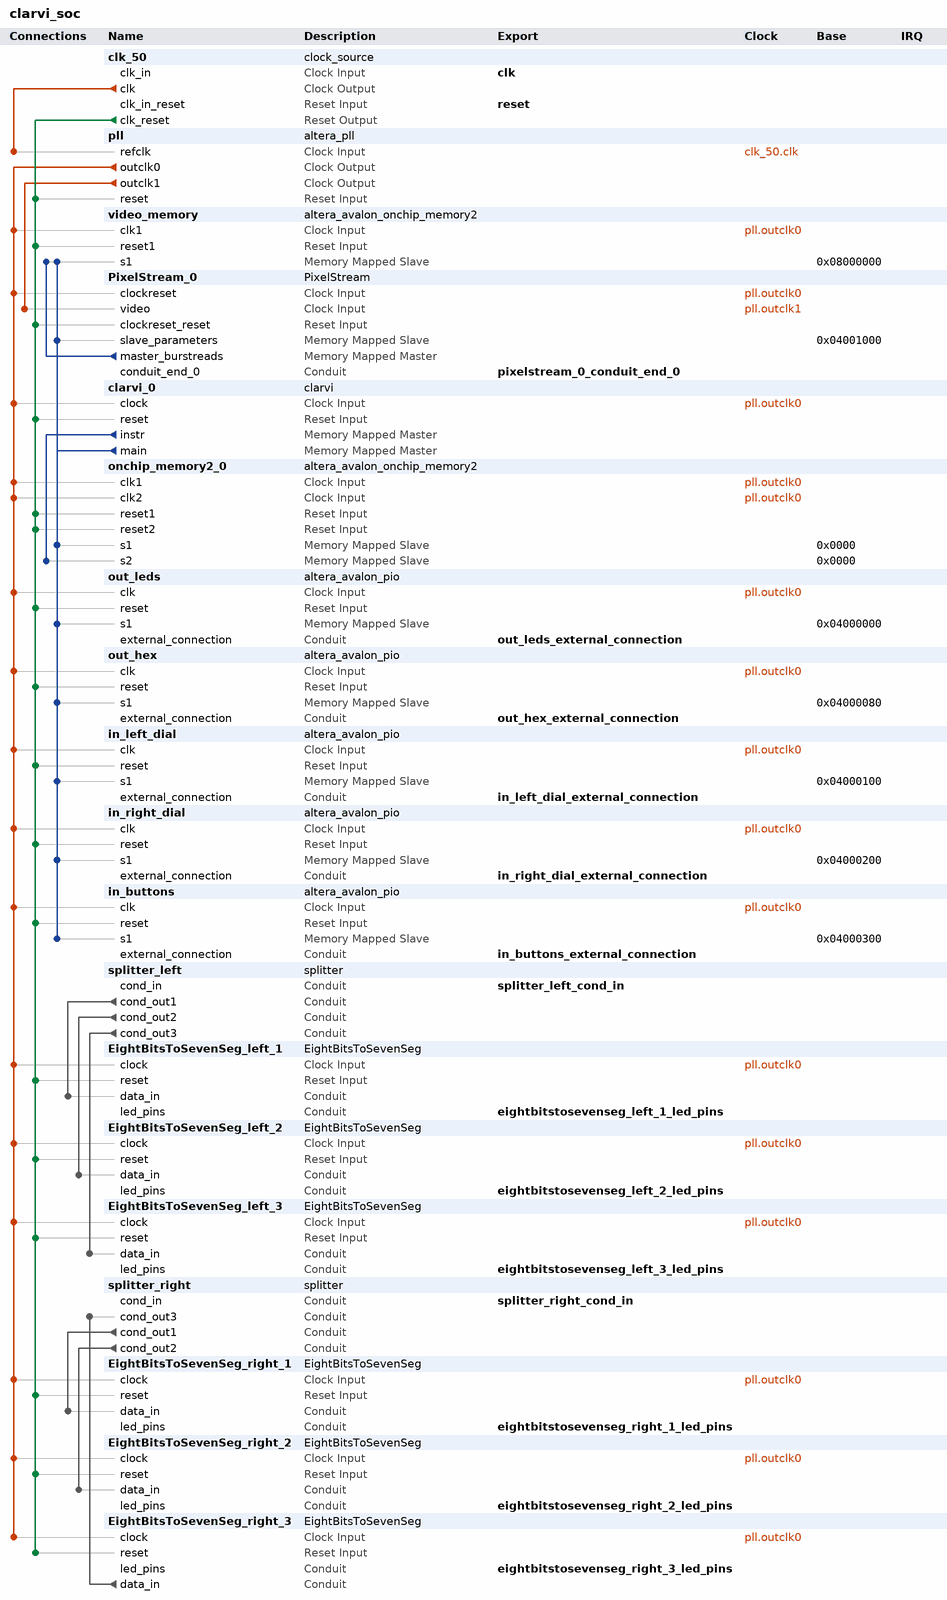
[diagram p0: system contents]
# Platform Designer (Qsys) system clarvi_soc, Cyclone V 5CSEMA5F31C6
# Parameters at their usual value, and those the tool derives, are not listed.
package require -exact qsys 16.1
create_system clarvi_soc
set_project_property DEVICE_FAMILY {Cyclone V}
set_project_property DEVICE 5CSEMA5F31C6

add_instance clk_50 clock_source 16.1
set_instance_parameter_value clk_50 clockFrequency 50000000

add_instance pll altera_pll 16.1
set_instance_parameter_value pll gui_device_speed_grade 2
set_instance_parameter_value pll gui_number_of_clocks 2
set_instance_parameter_value pll gui_operation_mode direct
set_instance_parameter_value pll gui_output_clock_frequency0 50.0
set_instance_parameter_value pll gui_output_clock_frequency1 9.0
set_instance_parameter_value pll gui_pll_mode {Integer-N PLL}
set_instance_parameter_value pll gui_reference_clock_frequency 50.0
set_instance_parameter_value pll gui_use_locked false

add_instance video_memory altera_avalon_onchip_memory2 16.1
set_instance_parameter_value video_memory dataWidth 32
set_instance_parameter_value video_memory dualPort false
set_instance_parameter_value video_memory initMemContent false
set_instance_parameter_value video_memory initializationFileName onchip_mem.hex
set_instance_parameter_value video_memory memorySize 261120

add_instance PixelStream_0 PixelStream 1.0

add_instance clarvi_0 clarvi 1.0
set_instance_parameter_value clarvi_0 DATA_ADDR_WIDTH 29
set_instance_parameter_value clarvi_0 DEFAULT_TRAP_VECTOR 0
set_instance_parameter_value clarvi_0 INITIAL_PC 0
set_instance_parameter_value clarvi_0 INSTR_ADDR_WIDTH 14

add_instance onchip_memory2_0 altera_avalon_onchip_memory2 16.1
set_instance_parameter_value onchip_memory2_0 dataWidth 32
set_instance_parameter_value onchip_memory2_0 dualPort true
set_instance_parameter_value onchip_memory2_0 initMemContent true
set_instance_parameter_value onchip_memory2_0 initializationFileName mem.hex
set_instance_parameter_value onchip_memory2_0 memorySize 65536
set_instance_parameter_value onchip_memory2_0 useNonDefaultInitFile true

add_instance out_leds altera_avalon_pio 16.1
set_instance_parameter_value out_leds direction Output
set_instance_parameter_value out_leds width 10

add_instance out_hex altera_avalon_pio 16.1
set_instance_parameter_value out_hex direction Output
set_instance_parameter_value out_hex width 24

add_instance in_left_dial altera_avalon_pio 16.1
set_instance_parameter_value in_left_dial direction Input
set_instance_parameter_value in_left_dial width 8

add_instance in_right_dial altera_avalon_pio 16.1
set_instance_parameter_value in_right_dial direction Input
set_instance_parameter_value in_right_dial width 8

add_instance in_buttons altera_avalon_pio 16.1
set_instance_parameter_value in_buttons direction Input
set_instance_parameter_value in_buttons width 16

add_instance splitter_left splitter 1.0

add_instance EightBitsToSevenSeg_left_1 EightBitsToSevenSeg 1.0

add_instance EightBitsToSevenSeg_left_2 EightBitsToSevenSeg 1.0

add_instance EightBitsToSevenSeg_left_3 EightBitsToSevenSeg 1.0

add_instance splitter_right splitter 1.0

add_instance EightBitsToSevenSeg_right_1 EightBitsToSevenSeg 1.0

add_instance EightBitsToSevenSeg_right_2 EightBitsToSevenSeg 1.0

add_instance EightBitsToSevenSeg_right_3 EightBitsToSevenSeg 1.0

# connections
add_connection clk_50.clk pll.refclk clock
add_connection pll.outclk0 clarvi_0.clock clock
add_connection pll.outclk0 EightBitsToSevenSeg_left_1.clock clock
add_connection pll.outclk0 EightBitsToSevenSeg_left_2.clock clock
add_connection pll.outclk0 EightBitsToSevenSeg_left_3.clock clock
add_connection pll.outclk0 EightBitsToSevenSeg_right_1.clock clock
add_connection pll.outclk0 EightBitsToSevenSeg_right_2.clock clock
add_connection pll.outclk0 EightBitsToSevenSeg_right_3.clock clock
add_connection pll.outclk0 in_buttons.clk clock
add_connection pll.outclk0 in_left_dial.clk clock
add_connection pll.outclk0 in_right_dial.clk clock
add_connection pll.outclk0 onchip_memory2_0.clk1 clock
add_connection pll.outclk0 onchip_memory2_0.clk2 clock
add_connection pll.outclk0 out_hex.clk clock
add_connection pll.outclk0 out_leds.clk clock
add_connection pll.outclk0 PixelStream_0.clockreset clock
add_connection pll.outclk0 video_memory.clk1 clock
add_connection pll.outclk1 PixelStream_0.video clock
add_connection clk_50.clk_reset clarvi_0.reset reset
add_connection clk_50.clk_reset EightBitsToSevenSeg_left_1.reset reset
add_connection clk_50.clk_reset EightBitsToSevenSeg_left_2.reset reset
add_connection clk_50.clk_reset EightBitsToSevenSeg_left_3.reset reset
add_connection clk_50.clk_reset EightBitsToSevenSeg_right_1.reset reset
add_connection clk_50.clk_reset EightBitsToSevenSeg_right_2.reset reset
add_connection clk_50.clk_reset EightBitsToSevenSeg_right_3.reset reset
add_connection clk_50.clk_reset in_buttons.reset reset
add_connection clk_50.clk_reset in_left_dial.reset reset
add_connection clk_50.clk_reset in_right_dial.reset reset
add_connection clk_50.clk_reset onchip_memory2_0.reset1 reset
add_connection clk_50.clk_reset onchip_memory2_0.reset2 reset
add_connection clk_50.clk_reset out_hex.reset reset
add_connection clk_50.clk_reset out_leds.reset reset
add_connection clk_50.clk_reset PixelStream_0.clockreset_reset reset
add_connection clk_50.clk_reset pll.reset reset
add_connection clk_50.clk_reset video_memory.reset1 reset
add_connection clarvi_0.instr onchip_memory2_0.s2 avalon
set_connection_parameter_value clarvi_0.instr/onchip_memory2_0.s2 baseAddress 0x0000
add_connection clarvi_0.main in_buttons.s1 avalon
set_connection_parameter_value clarvi_0.main/in_buttons.s1 baseAddress 0x04000300
add_connection clarvi_0.main in_left_dial.s1 avalon
set_connection_parameter_value clarvi_0.main/in_left_dial.s1 baseAddress 0x04000100
add_connection clarvi_0.main in_right_dial.s1 avalon
set_connection_parameter_value clarvi_0.main/in_right_dial.s1 baseAddress 0x04000200
add_connection clarvi_0.main onchip_memory2_0.s1 avalon
set_connection_parameter_value clarvi_0.main/onchip_memory2_0.s1 baseAddress 0x0000
add_connection clarvi_0.main out_hex.s1 avalon
set_connection_parameter_value clarvi_0.main/out_hex.s1 baseAddress 0x04000080
add_connection clarvi_0.main out_leds.s1 avalon
set_connection_parameter_value clarvi_0.main/out_leds.s1 baseAddress 0x04000000
add_connection clarvi_0.main PixelStream_0.slave_parameters avalon
set_connection_parameter_value clarvi_0.main/PixelStream_0.slave_parameters baseAddress 0x04001000
add_connection clarvi_0.main video_memory.s1 avalon
set_connection_parameter_value clarvi_0.main/video_memory.s1 baseAddress 0x08000000
add_connection PixelStream_0.master_burstreads video_memory.s1 avalon
set_connection_parameter_value PixelStream_0.master_burstreads/video_memory.s1 baseAddress 0x08000000
add_connection EightBitsToSevenSeg_right_3.data_in splitter_right.cond_out3 conduit
add_connection splitter_left.cond_out1 EightBitsToSevenSeg_left_1.data_in conduit
add_connection splitter_left.cond_out2 EightBitsToSevenSeg_left_2.data_in conduit
add_connection splitter_left.cond_out3 EightBitsToSevenSeg_left_3.data_in conduit
add_connection splitter_right.cond_out1 EightBitsToSevenSeg_right_1.data_in conduit
add_connection splitter_right.cond_out2 EightBitsToSevenSeg_right_2.data_in conduit

# exported interfaces
add_interface clk clock sink
set_interface_property clk EXPORT_OF clk_50.clk_in
add_interface eightbitstosevenseg_left_1_led_pins conduit end
set_interface_property eightbitstosevenseg_left_1_led_pins EXPORT_OF EightBitsToSevenSeg_left_1.led_pins
add_interface eightbitstosevenseg_left_2_led_pins conduit end
set_interface_property eightbitstosevenseg_left_2_led_pins EXPORT_OF EightBitsToSevenSeg_left_2.led_pins
add_interface eightbitstosevenseg_left_3_led_pins conduit end
set_interface_property eightbitstosevenseg_left_3_led_pins EXPORT_OF EightBitsToSevenSeg_left_3.led_pins
add_interface eightbitstosevenseg_right_1_led_pins conduit end
set_interface_property eightbitstosevenseg_right_1_led_pins EXPORT_OF EightBitsToSevenSeg_right_1.led_pins
add_interface eightbitstosevenseg_right_2_led_pins conduit end
set_interface_property eightbitstosevenseg_right_2_led_pins EXPORT_OF EightBitsToSevenSeg_right_2.led_pins
add_interface eightbitstosevenseg_right_3_led_pins conduit end
set_interface_property eightbitstosevenseg_right_3_led_pins EXPORT_OF EightBitsToSevenSeg_right_3.led_pins
add_interface in_buttons_external_connection conduit end
set_interface_property in_buttons_external_connection EXPORT_OF in_buttons.external_connection
add_interface in_left_dial_external_connection conduit end
set_interface_property in_left_dial_external_connection EXPORT_OF in_left_dial.external_connection
add_interface in_right_dial_external_connection conduit end
set_interface_property in_right_dial_external_connection EXPORT_OF in_right_dial.external_connection
add_interface out_hex_external_connection conduit end
set_interface_property out_hex_external_connection EXPORT_OF out_hex.external_connection
add_interface out_leds_external_connection conduit end
set_interface_property out_leds_external_connection EXPORT_OF out_leds.external_connection
add_interface pixelstream_0_conduit_end_0 conduit end
set_interface_property pixelstream_0_conduit_end_0 EXPORT_OF PixelStream_0.conduit_end_0
add_interface reset reset sink
set_interface_property reset EXPORT_OF clk_50.clk_in_reset
add_interface splitter_left_cond_in conduit end
set_interface_property splitter_left_cond_in EXPORT_OF splitter_left.cond_in
add_interface splitter_right_cond_in conduit end
set_interface_property splitter_right_cond_in EXPORT_OF splitter_right.cond_in

set_interconnect_requirement {$system} qsys_mm.clockCrossingAdapter HANDSHAKE
set_interconnect_requirement {$system} qsys_mm.enableEccProtection FALSE
set_interconnect_requirement {$system} qsys_mm.insertDefaultSlave FALSE
set_interconnect_requirement {$system} qsys_mm.maxAdditionalLatency 1

save_system clarvi_soc.qsys
